# Altium schematic sheet main.SchDoc
size A4; SheetNumber: 1; SheetTotal: 4
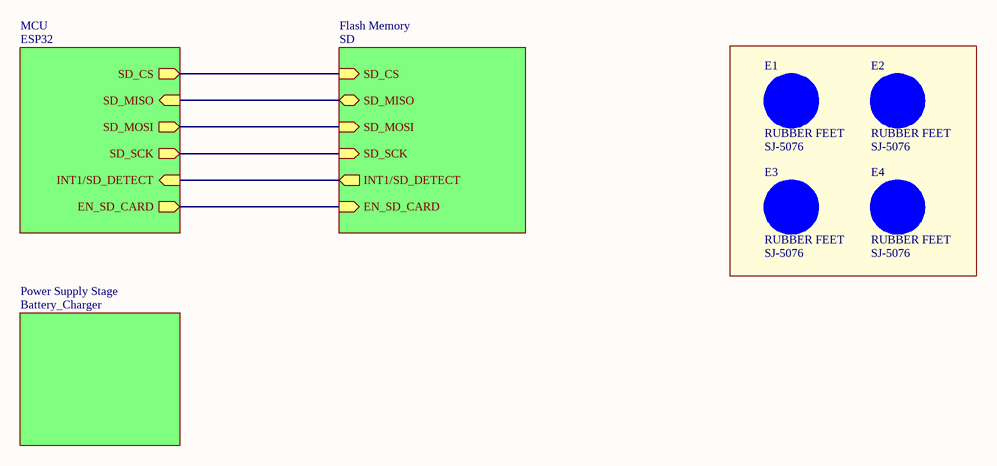
[diagram p0: main.SchDoc]

## Parts
E1  RUBBER FEET  value SJ-5076  [AP8-00192]
E2  RUBBER FEET  value SJ-5076  [AP8-00192]
E3  RUBBER FEET  value SJ-5076  [AP8-00192]
E4  RUBBER FEET  value SJ-5076  [AP8-00192]

## Sub-sheets
Flash Memory = SD: INT1/SD_DETECT (out), SD_MOSI (in), EN_SD_CARD (in), SD_MISO (bidir), SD_CS (in), SD_SCK (in)
MCU = ESP32: SD_CS (out), SD_MISO (in), SD_MOSI (out), SD_SCK (out), INT1/SD_DETECT (in), EN_SD_CARD (out)
Power Supply Stage = Battery_Charger: no entries

## Nets
(unnamed): sheet MCU/SD_CS, sheet Flash Memory/SD_CS
(unnamed): sheet MCU/SD_MISO, sheet Flash Memory/SD_MISO
(unnamed): sheet MCU/SD_MOSI, sheet Flash Memory/SD_MOSI
(unnamed): sheet MCU/SD_SCK, sheet Flash Memory/SD_SCK
(unnamed): sheet MCU/INT1/SD_DETECT, sheet Flash Memory/INT1/SD_DETECT
(unnamed): sheet MCU/EN_SD_CARD, sheet Flash Memory/EN_SD_CARD

## Library data of the parts
E1-E4 = RUBBER FEET: 2.8mm adhesive feet,diam 8.0mm; PartGroup: Mechanical devices,Mounting accessories; Manufacturer: 3M; AN: A08-0053; ComponentStatus: 'Active (verified)'; Verified date: 2006-05-05; Verified by: Ketil Skjerve; Status: Active; Height: 2.79999995231628; FootprintStatus: 'Active (Verified)'